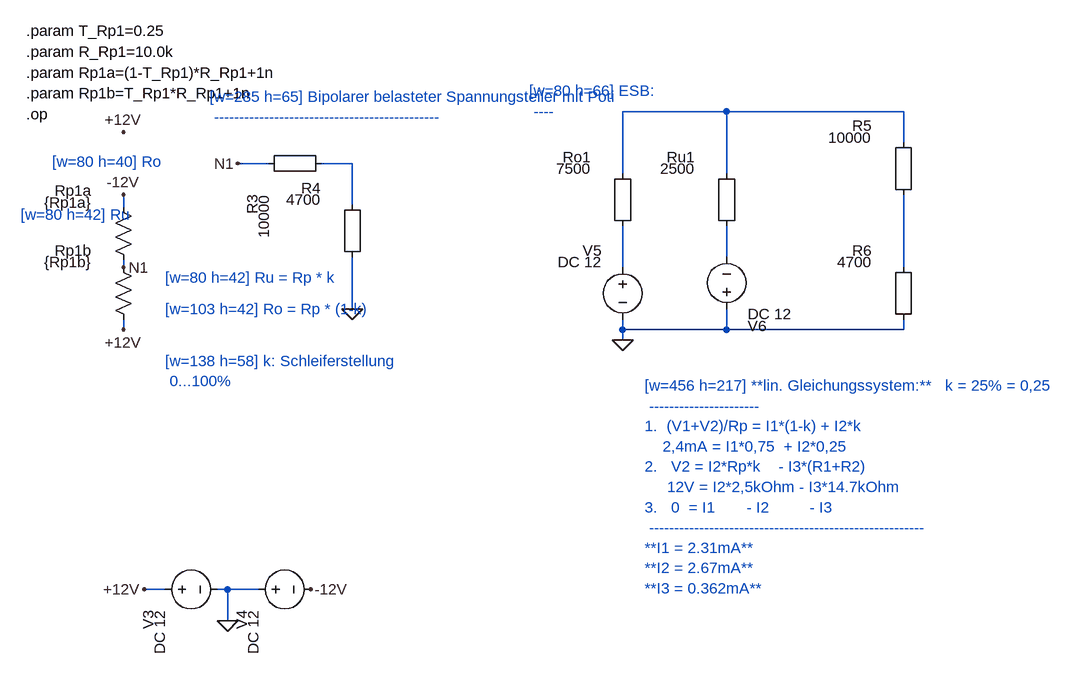
[diagram p0: schematic 1_2_3_Belasteter_Spannungsteiler_mit_Poti.asc]
1_2_3_Belasteter_Spannungsteiler_mit_Poti.asc, the LTspice schematic file:
Version 4
SHEET 1 880 680
WIRE 512 528 512 448
WIRE 320 1008 320 960
WIRE 320 960 304 960
WIRE 320 960 368 960
WIRE 928 576 928 560
WIRE 928 560 928 544
WIRE 928 560 1088 560
WIRE 1088 560 1088 528
WIRE 1088 560 1360 560
WIRE 1360 560 1360 544
WIRE 192 960 224 960
WIRE 160 560 160 544
WIRE 160 352 160 372
WIRE 160 464 160 452
WIRE 336 304 384 304
WIRE 464 304 512 304
WIRE 512 304 512 368
WIRE 928 464 928 400
WIRE 1088 448 1088 400
WIRE 928 320 928 224
WIRE 928 224 1088 224
WIRE 1088 224 1088 320
WIRE 1088 224 1360 224
WIRE 1360 224 1360 272
WIRE 1360 352 1360 432
WIRE 1360 432 1360 464
FLAG 512 528 0
FLAG 320 1008 0
FLAG 928 576 0
FLAG 192 960 +12V
FLAG 160 256 +12V
FLAG 160 560 +12V
FLAG 448 960 -12V
FLAG 160 352 -12V
FLAG 160 464 N1
FLAG 336 304 N1
SYMBOL Misc\EuropeanResistor 368 320 R270
WINDOW 0 -32 -10 Right 2
WINDOW 3 -32 8 Right 2
SYMATTR InstName R3
SYMATTR Value 10000
SYMBOL Misc\EuropeanResistor 496 352 R0
WINDOW 0 -32 -10 Right 2
WINDOW 3 -32 8 Right 2
SYMATTR InstName R4
SYMATTR Value 4700
SYMBOL res 144 356 R0
WINDOW 0 -32 -10 Right 2
WINDOW 3 -32 8 Right 2
SYMATTR InstName Rp1a
SYMATTR Value {Rp1a}
SYMBOL res 144 448 R0
WINDOW 0 -32 -10 Right 2
WINDOW 3 -32 8 Right 2
SYMATTR InstName Rp1b
SYMATTR Value {Rp1b}
SYMBOL voltage 208 960 R270
WINDOW 0 -32 -10 Right 2
WINDOW 3 -32 8 Right 2
SYMATTR InstName V3
SYMATTR Value DC 12
SYMBOL voltage 352 960 R270
WINDOW 0 -32 -10 Right 2
WINDOW 3 -32 8 Right 2
SYMATTR InstName V4
SYMATTR Value DC 12
SYMBOL voltage 928 448 R0
WINDOW 0 -32 -10 Right 2
WINDOW 3 -32 8 Right 2
SYMATTR InstName V5
SYMATTR Value DC 12
SYMBOL voltage 1088 544 R180
WINDOW 0 -32 -10 Right 2
WINDOW 3 -32 8 Right 2
SYMATTR InstName V6
SYMATTR Value DC 12
SYMBOL Misc\EuropeanResistor 912 304 R0
WINDOW 0 -32 -10 Right 2
WINDOW 3 -32 8 Right 2
SYMATTR InstName Ro1
SYMATTR Value 7500
SYMBOL Misc\EuropeanResistor 1072 304 R0
WINDOW 0 -32 -10 Right 2
WINDOW 3 -32 8 Right 2
SYMATTR InstName Ru1
SYMATTR Value 2500
SYMBOL Misc\EuropeanResistor 1344 256 R0
WINDOW 0 -32 -10 Right 2
WINDOW 3 -32 8 Right 2
SYMATTR InstName R5
SYMATTR Value 10000
SYMBOL Misc\EuropeanResistor 1344 448 R0
WINDOW 0 -32 -10 Right 2
WINDOW 3 -32 8 Right 2
SYMATTR InstName R6
SYMATTR Value 4700
TEXT 10 100 Left 2 !.param T_Rp1=0.25
TEXT 10 132 Left 2 !.param R_Rp1=10.0k
TEXT 10 164 Left 2 !.param Rp1a=(1-T_Rp1)*R_Rp1+1n
TEXT 10 196 Left 2 !.param Rp1b=T_Rp1*R_Rp1+1n
TEXT 10 228 Left 2 !.op
TEXT 293 201 Left 2 ;[w=285 h=65] Bipolarer belasteter Spannungsteiler mit Poti \n ---------------------------------------------
TEXT 784 192 Left 2 ;[w=80 h=66] ESB: \n ----
TEXT 50 301 Left 2 ;[w=80 h=40] Ro
TEXT 2 383 Left 2 ;[w=80 h=42] Ru
TEXT 224 480 Left 2 ;[w=80 h=42] Ru = Rp * k
TEXT 224 528 Left 2 ;[w=103 h=42] Ro = Rp * (1-k)
TEXT 224 608 Left 2 ;[w=138 h=58] k: Schleiferstellung \n 0...100%
TEXT 962 646 Left 2 ;[w=456 h=217] **lin. Gleichungssystem:**   k = 25% = 0,25 \n ---------------------- \n1.  (V1+V2)/Rp = I1*(1-k) + I2*k \n    2,4mA = I1*0,75  + I2*0,25 \n2.   V2 = I2*Rp*k    - I3*(R1+R2) \n     12V = I2*2,5kOhm - I3*14.7kOhm \n3.   0  = I1       - I2         - I3 \n ------------------------------------------------------- \n**I1 = 2.31mA**\n**I2 = 2.67mA**  \n**I3 = 0.362mA**

The netlist it stands for:
* 1_2_3_Belasteter_Spannungsteiler_mit_Poti.asc
R3 N1 N001 10000
R4 N001 0 4700
Rp1a -12V N1 {Rp1a}
Rp1b N1 +12V {Rp1b}
V3 +12V 0 DC 12
V4 0 -12V DC 12
V5 N002 0 DC 12
V6 0 N003 DC 12
Ro1 N004 N002 7500
Ru1 N004 N003 2500
R5 N004 N005 10000
R6 N005 0 4700
.param T_Rp1=0.25
.param R_Rp1=10.0k
.param Rp1a=(1-T_Rp1)*R_Rp1+1n
.param Rp1b=T_Rp1*R_Rp1+1n
.op
* [w=285 h=65] Bipolarer belasteter Spannungsteiler mit Poti
*  ---------------------------------------------
* [w=80 h=66] ESB:
*  ----
* [w=80 h=40] Ro
* [w=80 h=42] Ru
* [w=80 h=42] Ru = Rp * k
* [w=103 h=42] Ro = Rp * (1-k)
* [w=138 h=58] k: Schleiferstellung
*  0...100%
* [w=456 h=217] **lin. Gleichungssystem:**   k = 25% = 0,25
*  ----------------------
* 1.  (V1+V2)/Rp = I1*(1-k) + I2*k
*     2,4mA = I1*0,75  + I2*0,25
* 2.   V2 = I2*Rp*k    - I3*(R1+R2)
*      12V = I2*2,5kOhm - I3*14.7kOhm
* 3.   0  = I1       - I2         - I3
*  -------------------------------------------------------
* **I1 = 2.31mA**
* **I2 = 2.67mA**
* **I3 = 0.362mA**
.backanno
.end